# EAGLE design RPi-Power-HAT_v06 (EAGLE 6.4)
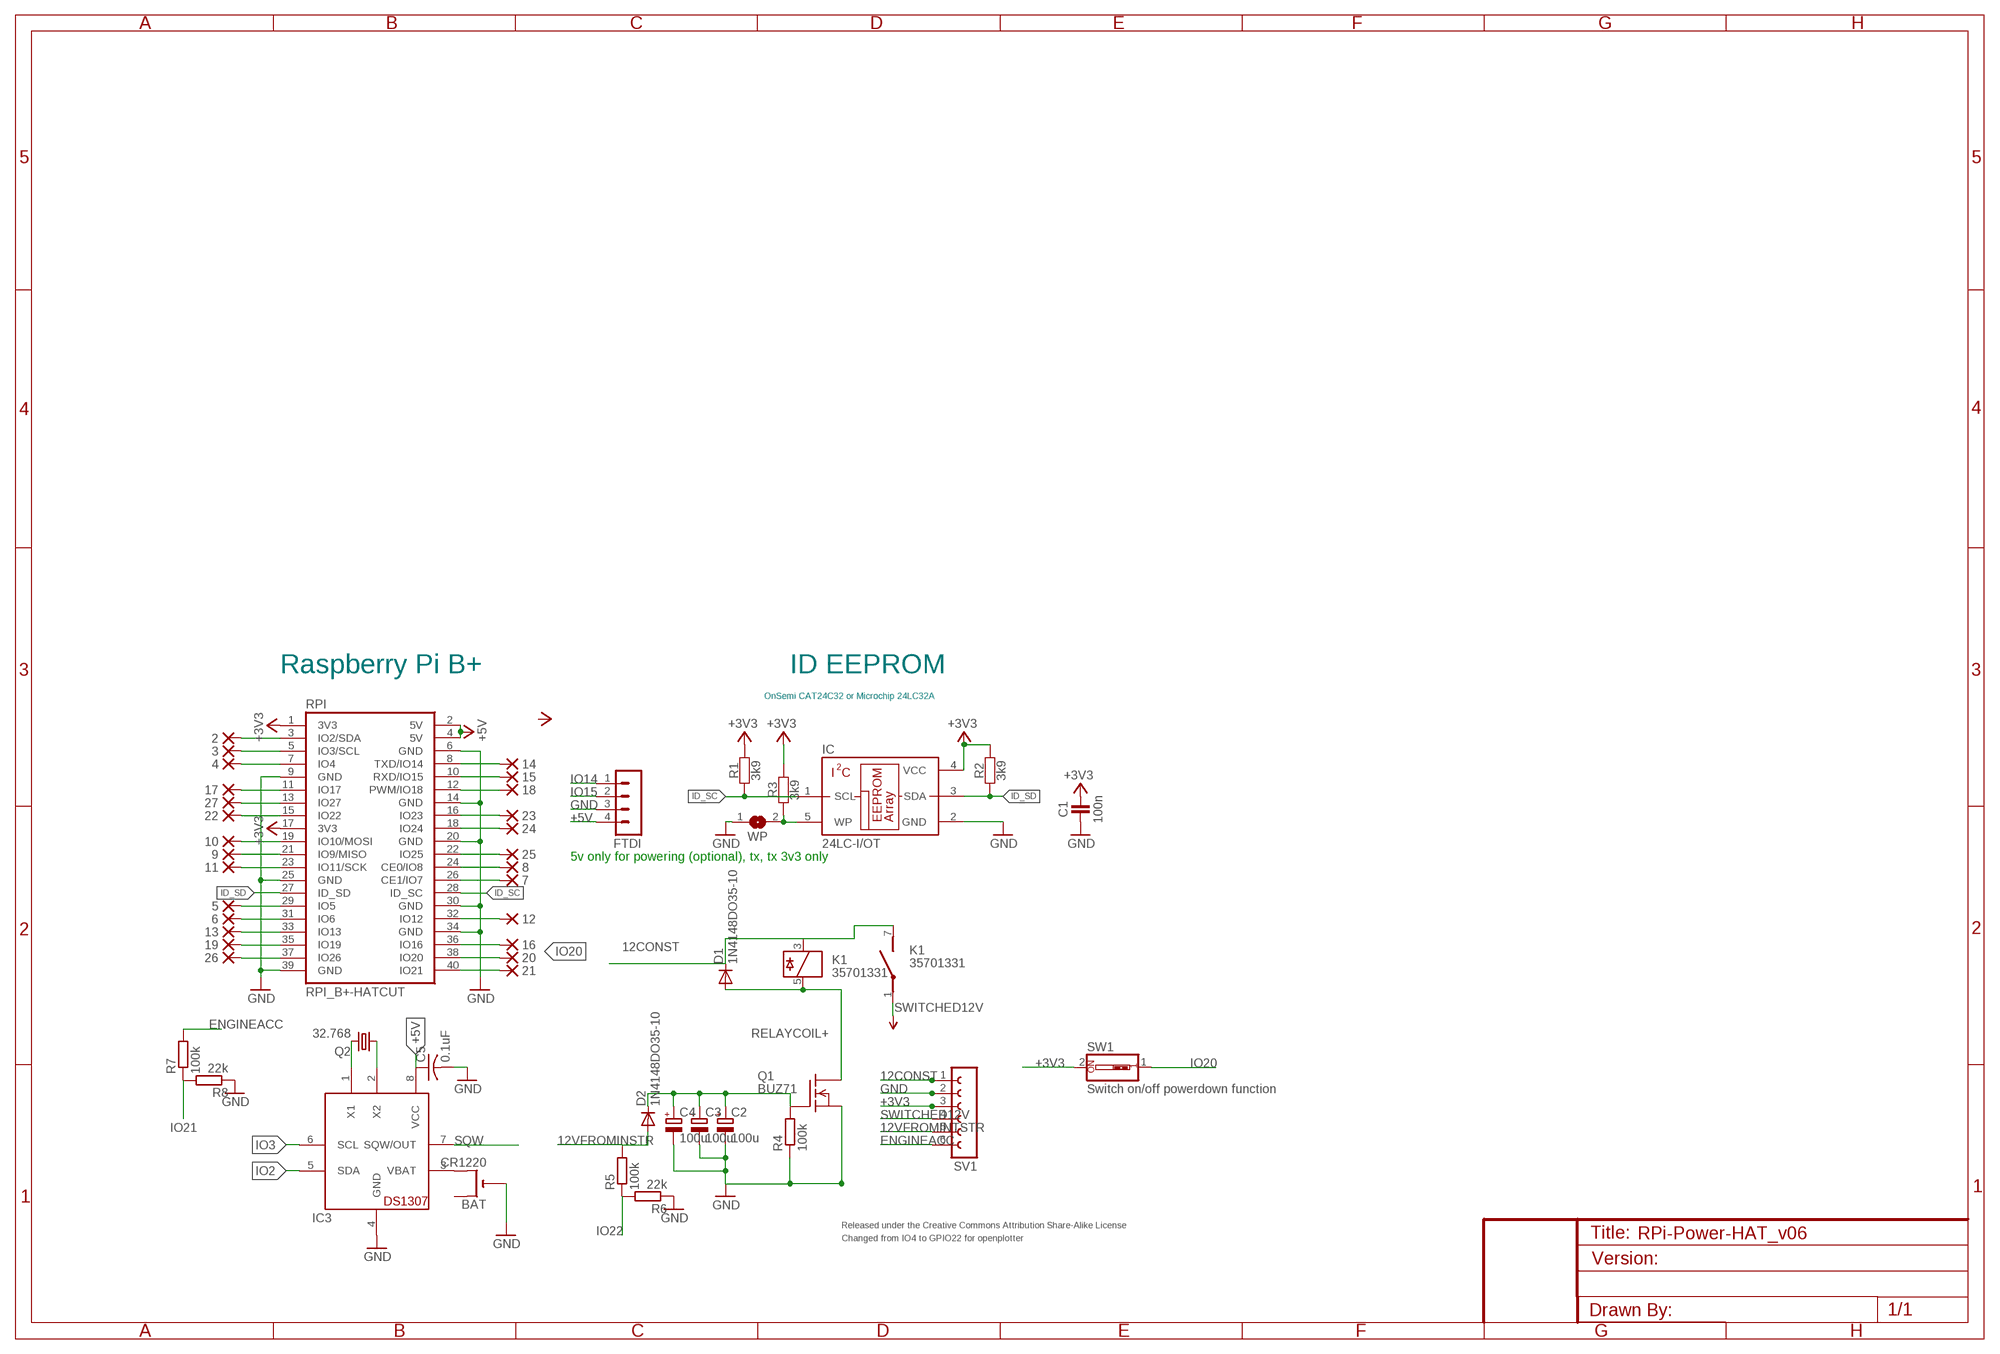
[diagram p0: schematic, sheet 1]

## Parts
2  PAD-1-1.6  [PAD-1-1.6]
3  PAD-1-1.6  [PAD-1-1.6]
4  PAD-1-1.6  [PAD-1-1.6]
5  PAD-1-1.6  [PAD-1-1.6]
6  PAD-1-1.6  [PAD-1-1.6]
7  PAD-1-1.6  [PAD-1-1.6]
8  PAD-1-1.6  [PAD-1-1.6]
9  PAD-1-1.6  [PAD-1-1.6]
10  PAD-1-1.6  [PAD-1-1.6]
11  PAD-1-1.6  [PAD-1-1.6]
12  PAD-1-1.6  [PAD-1-1.6]
13  PAD-1-1.6  [PAD-1-1.6]
14  PAD-1-1.6  [PAD-1-1.6]
15  PAD-1-1.6  [PAD-1-1.6]
16  PAD-1-1.6  [PAD-1-1.6]
17  PAD-1-1.6  [PAD-1-1.6]
18  PAD-1-1.6  [PAD-1-1.6]
19  PAD-1-1.6  [PAD-1-1.6]
20  PAD-1-1.6  [PAD-1-1.6]
21  PAD-1-1.6  [PAD-1-1.6]
22  PAD-1-1.6  [PAD-1-1.6]
23  PAD-1-1.6  [PAD-1-1.6]
24  PAD-1-1.6  [PAD-1-1.6]
25  PAD-1-1.6  [PAD-1-1.6]
26  PAD-1-1.6  [PAD-1-1.6]
27  PAD-1-1.6  [PAD-1-1.6]
BAT  CR1220  ADAFRUIT_CR1220THM  [ADAFRUIT_CR1220-THM]
C1  100n  CAPACITOR-C0603  [R0603]
C2  100u  CPOL-EUE2-4  [E2-4]
C3  100u  CPOL-EUE2-4  [E2-4]
C4  100u  CPOL-EUE2-4  [E2-4]
C5  0.1uF  C-US025-025X050  [C025-025X050]
D1  1N4148DO35-10  [DO35-10]
D2  1N4148DO35-10  [DO35-10]
FTDI  MA04-1  [MA04-1]
IC  24LC-I/OT  [SOT23-5]
IC3  DS1307  [DIL08]
K1  35701331  [REED]
Q1  BUZ71  [TO220]
Q2  32.768  CRYTALTC38H  [TC38H]
R1  3k9  RESISTOR-R0603  [R0603]
R2  3k9  RESISTOR-R0603  [R0603]
R3  3k9  RESISTOR-R0603  [R0603]
R4  100k  R-EU_0207/2V  [0207/2V]
R5  100k  R-EU_0207/2V  [0207/2V]
R6  22k  R-EU_0207/2V  [0207/2V]
R7  100k  R-EU_0207/2V  [0207/2V]
R8  22k  R-EU_0207/2V  [0207/2V]
RPI  RPI_B+-HATCUT  [RPI-B+HAT_CUTOUT]
SV1  FE06-1  [FE06]
SW1  Switch on/off powerdown function  SW_DIP-1  [EDG-01]
WP  JUMPER2-NOCREAM  [JUMPER2_NC]

## Nets
12CONST: D1.C K1.3 K1.7(2:S) SV1.1
12VFROMINSTR: D2.A R5.2
12VFROMINTSTR: SV1.5
+3V3: C1.2 IC.4(VCC) R1.2 R2.2 R3.2 RPI.1(3V3) RPI.17(3V3) SV1.3 SW1.2
+5V: FTDI.4 IC3.8(VCC) RPI.2(5V) RPI.4(5V)
ENGINEACC: R7.2 SV1.6
GND: BAT.- C1.1 C2.- C3.- C4.- C5.2 FTDI.3 IC3.4(GND) IC.2(GND) Q1.3(S) R4.1 R6.1 R8.1 RPI.6(GND) RPI.9(GND) RPI.14(GND) RPI.20(GND) RPI.25(GND) RPI.30(GND) RPI.34(GND) RPI.39(GND) SV1.2 WP.1
ID_SC: IC.1(SCL) R1.1 RPI.28(ID_SC)
ID_SD: IC.3(SDA) R2.1 RPI.27(ID_SD)
IO2: 2.1(P) IC3.5(SDA) RPI.3(IO2/SDA)
IO3: 3.1(P) IC3.6(SCL) RPI.5(IO3/SCL)
IO4: 4.1(P) RPI.7(IO4)
IO5: 5.1(P) RPI.29(IO5)
IO6: 6.1(P) RPI.31(IO6)
IO7: 7.1(P) RPI.26(CE1/IO7)
IO8: 8.1(P) RPI.24(CE0/IO8)
IO9: 9.1(P) RPI.21(IO9/MISO)
IO10: 10.1(P) RPI.19(IO10/MOSI)
IO11: 11.1(P) RPI.23(IO11/SCK)
IO12: 12.1(P) RPI.32(IO12)
IO13: 13.1(P) RPI.33(IO13)
IO14: 14.1(P) FTDI.1 RPI.8(TXD/IO14)
IO15: 15.1(P) FTDI.2 RPI.10(RXD/IO15)
IO16: 16.1(P) RPI.36(IO16)
IO17: 17.1(P) RPI.11(IO17)
IO18: 18.1(P) RPI.12(PWM/IO18)
IO19: 19.1(P) RPI.35(IO19)
IO20: 20.1(P) RPI.38(IO20) SW1.1
IO21: 21.1(P) R7.1 R8.2 RPI.40(IO21)
IO22: 22.1(P) R5.1 R6.2 RPI.15(IO22)
IO23: 23.1(P) RPI.16(IO23)
IO24: 24.1(P) RPI.18(IO24)
IO25: 25.1(P) RPI.22(IO25)
IO26: 26.1(P) RPI.37(IO26)
IO27: 27.1(P) RPI.13(IO27)
N$54: C2.+ C3.+ C4.+ D2.C Q1.1(G) R4.2
N$64: IC3.1(X1) Q2.2
N$110: IC3.2(X2) Q2.1
N$133: BAT.+2(+1) IC3.3(VBAT)
RELAYCOIL+: D1.A K1.5 Q1.2(D)
SQW: IC3.7(SQW/OUT)
SWITCHED12V: K1.1(2:P) SV1.4 ; supply symbol labelled VCC
WP: IC.5(WP) R3.1 WP.2
Unconnected: BAT.+1(+) C5.1

## Notes on the sheet
- Raspberry Pi B+ | ID EEPROM
- OnSemi CAT24C32 or Microchip 24LC32A
- 5v only for powering (optional), tx, tx 3v3 only
- Released under the Creative Commons Attribution Share-Alike License
- Changed from IO4 to GPIO22 for openplotter

## Library data of the parts
2-27 = we-rcl:PAD
BAT = RPi-Power-HAT_v02:ADAFRUIT_CR1220: CR1216/CR1220/CR1225 12mm 3V lithium coin cell Great for battery packup. Both SMT and THM holders. Note the THM package has the ground pads on both sides of the PCB so that the masks are the same - this reduces the cost
C1 = we-rcl:CAPACITOR: Capacitors ...2.2uF -> 0603 ...4.7uF -> 0805 ...10uF -> 1206
C2-C4 = resistor:CPOL-EU: POLARIZED CAPACITOR, European symbol
C5 = adafruit:C-US: CAPACITOR, American symbol
D1 D2 = diode:1N4148: DIODE high speed (Philips)
FTDI = con-lstb:MA04-1: PIN HEADER
IC = we-chip:24LC*: Microchip I2C EEPROM 2 Kbit - 24LC02B - 24LC02BT-I/OTDKR-ND 32 Kbit- 24LC32A - 24LC32AT-I/OTDKR-ND; DIGIKEY: 24LC32AT-I/OTDKR-ND
IC3 = adafruit:DS1307: DS1307 Real time clock (RTC) with battery backup ability. Talk to it via i2c
K1 = relay:35701331: RELAY reed, 1 x norm. open with polarity
Q1 = transistor-fet:BUZ71: N-Channel Enhancement MOSFET 50V; 14A; 0,1Ohm
Q2 = crystal:CRYTAL: CRYSTAL
R1-R3 = we-rcl:RESISTOR
R4-R8 = resistor:R-EU_: RESISTOR, European symbol
RPI = we-board:RPI_B+: Raspberry Pi Model B+
SV1 = con-lsta:FE06-1: FEMALE HEADER
SW1 = special:SW_DIP-1: DIP SWITCH
WP = we-rcl:JUMPER2

## Net classes
1 12v: width 0.508 mm

## Board
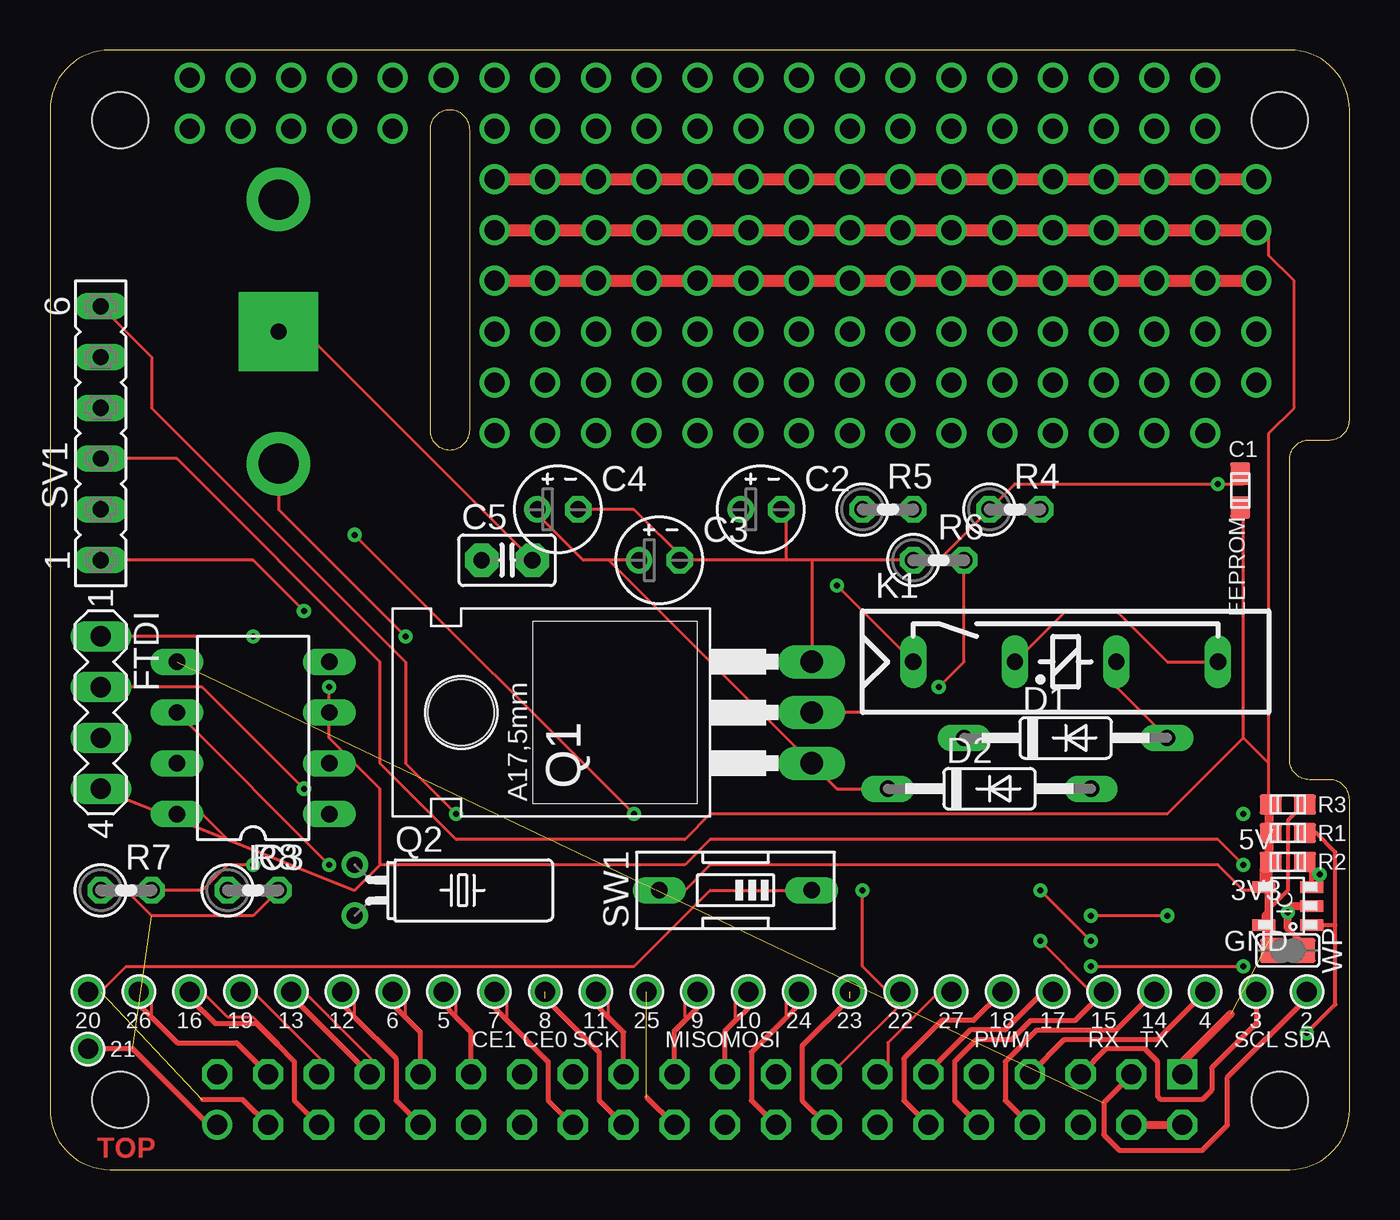
[diagram p1: board, top side]
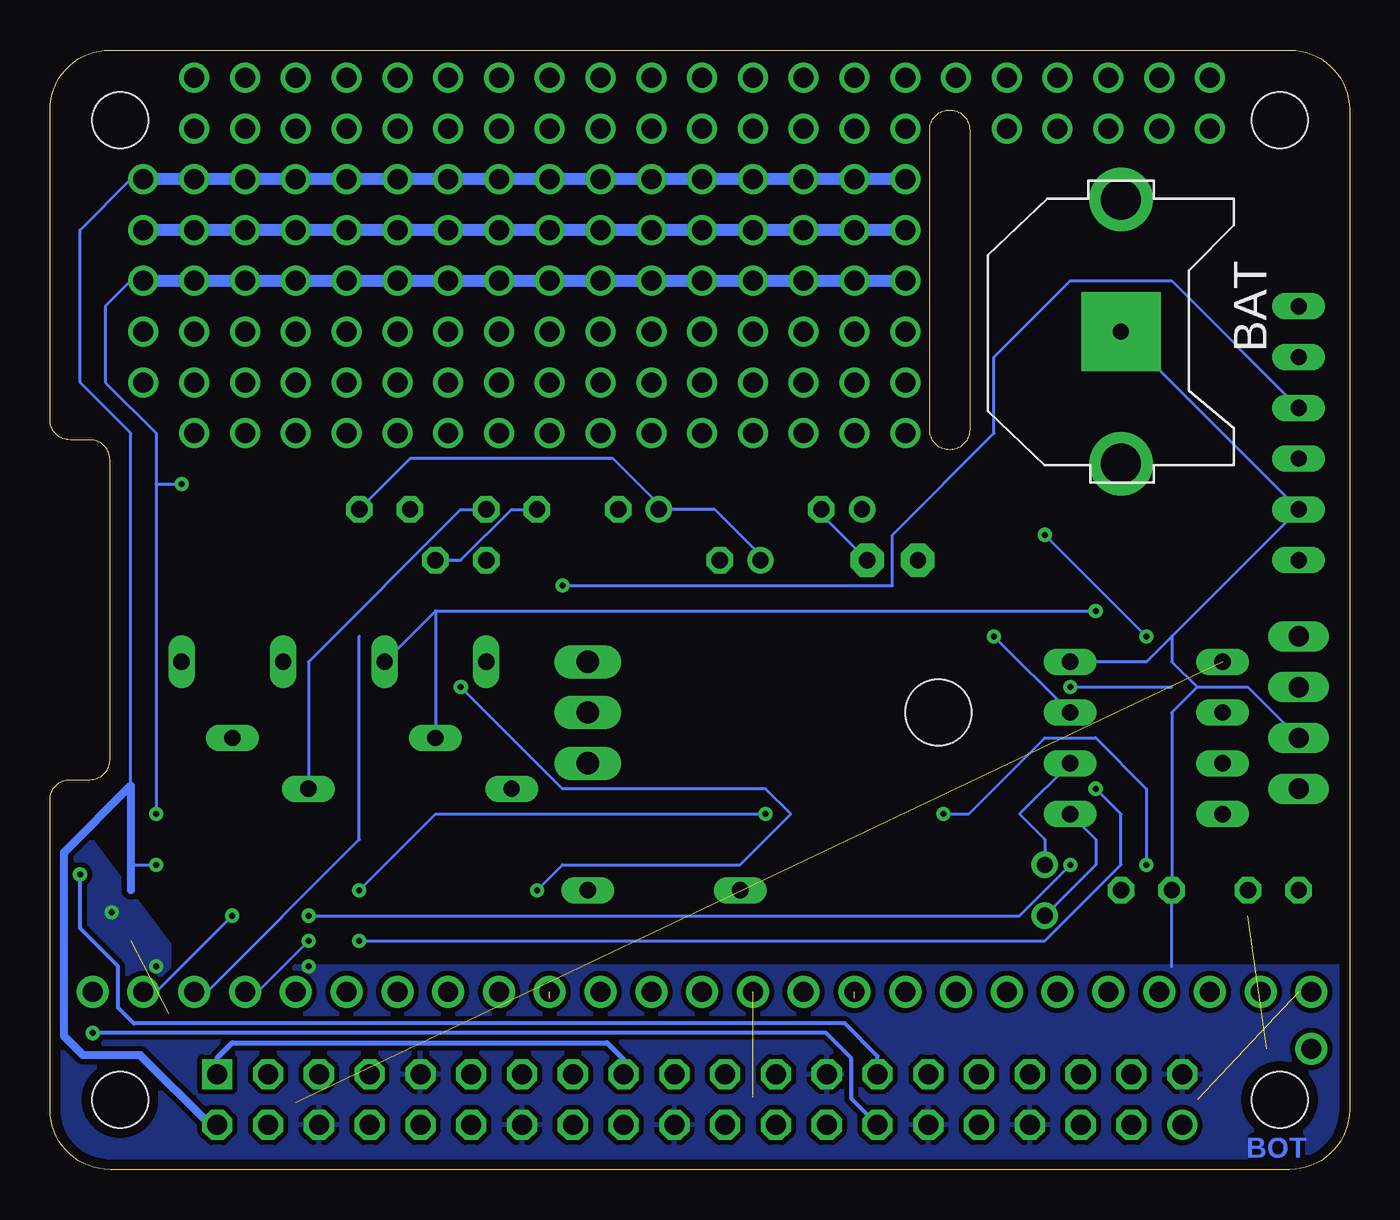
[diagram p2: board, bottom side, seen from below]

Size 65 x 56 mm. Coordinates in mm from the lower left corner, seen from the top.
Copper layers (1*16): Top 0.035mm / dielectric 1.5mm / Bottom 0.035mm
Design rules "default *": minimum track width 6mil, minimum drill 0.3mm, track to track 6mil, track to pad 6mil, pad to pad 6mil, via to via 6mil, smd to smd 6mil, copper to edge 20mil, drill to drill 8mil, minimum pad ring 10mil, minimum via ring 8mil, stop-mask expansion 0.3mm, vias tented up to drill 0.5mm, thermal gap 10mil

### Footprints (pad centres in the part's own frame; a part is rotated, then mirrored left to right if it is on the bottom)
PAD-1-1.6 = drill 1 pad 1.6: 1 0,0
ADAFRUIT_CR1220-THM = drill 2 pad 3.175: +1 -6.604,0; +2 6.604,0 | drill 0.8 pad 3.962 square: - 0,0
R0603 = smd 1 x 1.1: 1 0,0.85; 2 0,-0.85
E2-4 = drill 0.813 pad 1.27: + -1.016,0 | drill 0.813 pad 1.27 octagon: - 1.016,0
C025-025X050 = drill 0.813 pad 1.676 octagon: 1 -1.27,0; 2 1.27,0
DO35-10 = drill 0.813 long: A 5.08,0; C -5.08,0
MA04-1 = drill 1.016 long: 1 -3.81,0; 2 -1.27,0; 3 1.27,0; 4 3.81,0
SOT23-5 = smd 1.2 x 0.6: 1 -1.2,0.95; 2 -1.2,0; 3 -1.2,-0.95; 4 1.2,-0.95; 5 1.2,0.95
DIL08 = drill 0.813 long: 1 -3.81,-3.81; 2 -1.27,-3.81; 3 1.27,-3.81; 4 3.81,-3.81; 5 3.81,3.81; 6 1.27,3.81; 7 -1.27,3.81; 8 -3.81,3.81
REED = drill 0.813 long: 1 -17.78,2.54; 3 -12.7,2.54; 5 -7.62,2.54; 7 -2.54,2.54
TO220 = drill 1.118 long: 1 -2.54,-6.35; 2 0,-6.35; 3 2.54,-6.35 | hole 3.302: 0,11.176
TC38H = drill 0.813: 1 -1.27,0; 2 1.27,0
0207/2V = drill 0.813 octagon: 1 -1.27,0; 2 1.27,0
RPI-B+HAT_CUTOUT = drill 1 square: 1 56.63,4.77 | drill 1 octagon: 2 56.63,2.23; 3 54.09,4.77; 4 54.09,2.23; 5 51.55,4.77; 6 51.55,2.23; 7 49.01,4.77; 8 49.01,2.23; 9 46.47,4.77; 10 46.47,2.23; 11 43.93,4.77; 12 43.93,2.23; 13 41.39,4.77; 14 41.39,2.23; 15 38.85,4.77; 16 38.85,2.23; 17 36.31,4.77; 18 36.31,2.23; 19 33.77,4.77; 20 33.77,2.23; 21 31.23,4.77; 22 31.23,2.23; 23 28.69,4.77; 24 28.69,2.23; 25 26.15,4.77; 26 26.15,2.23; 27 23.61,4.77; 28 23.61,2.23; 29 21.07,4.77; 30 21.07,2.23; 31 18.53,4.77; 32 18.53,2.23; 33 15.99,4.77; 34 15.99,2.23; 35 13.45,4.77; 36 13.45,2.23; 37 10.91,4.77; 38 10.91,2.23; 39 8.37,4.77 | drill 1: 40 8.37,2.23 | hole 2.8: 3.5,3.5; 3.5,52.5; 61.5,52.5; 61.5,3.5
FE06 = drill 0.813 long: 1 -6.35,0; 2 -3.81,0; 3 -1.27,0; 4 1.27,0; 5 3.81,0; 6 6.35,0
EDG-01 = drill 0.813 long: 1 0,-3.81; 2 0,3.81
JUMPER2_NC = smd 1.25 x 1.25: 1 0,0.76; 2 0,-0.76

### Placement (x,y rotation side)
2  62.87,8.89 0 top
3  60.33,8.89 0 top
4  57.78,8.89 0 top
5  19.68,8.89 0 top
6  17.14,8.89 0 top
7  22.23,8.89 0 top
8  24.77,8.89 0 top
9  32.38,8.89 0 top
10  34.92,8.89 0 top
11  27.3,8.89 0 top
12  14.61,8.89 0 top
13  12.06,8.89 0 top
14  55.24,8.89 0 top
15  52.7,8.89 0 top
16  6.99,8.89 0 top
17  50.16,8.89 0 top
18  47.62,8.89 0 top
19  9.53,8.89 0 top
20  1.91,8.89 0 top
21  1.91,6.03 0 top
22  42.55,8.89 0 top
23  40.01,8.89 0 top
24  37.47,8.89 0 top
25  29.84,8.89 0 top
26  4.45,8.89 0 top
27  45.09,8.89 0 top
BAT  11.43,41.91 270 bottom
C1  59.53,33.97 0 top
C2  35.56,33.02 0 top
C3  30.48,30.48 0 top
C4  25.4,33.02 0 top
C5  22.86,30.48 0 top
D1  50.8,21.59 0 top
D2  46.99,19.05 0 top
FTDI  2.54,22.86 270 top
IC  61.91,13.18 180 top
IC3  10.16,21.59 90 top
K1  60.96,22.86 0 top
Q1  31.75,22.86 90 top
Q2  15.24,13.97 270 top
R1  61.91,16.83 270 top
R2  61.91,15.4 270 top
R3  61.91,18.26 270 top
R4  48.26,33.02 0 top
R5  41.91,33.02 0 top
R6  44.45,30.48 0 top
R7  3.81,13.97 0 top
R8  10.16,13.97 0 top
RPI  0,0 0 top
SV1  2.54,36.83 90 top
SW1  34.29,13.97 90 top
WP  61.91,10.95 270 top

### Tracks (layer width: path | path; a pad name or v marks a point on that pad's centre or on a via)
12CONST  (via drill 0.3)
  Top 0.152: K1.7 55.88,25.4 53.34,27.94 50.8,27.94 K1.3 | SV1.1 10.16,30.48 v12.7,27.94
  Bottom 0.152: 45.72,27.94 v12.7,27.94 | K1.3 45.72,27.94 | 45.72,27.94 D1.C
12VFROMINSTR
  Bottom 0.152: D2.A 52.07,25.4 44.45,33.02 R5.2
+3V3  (via drill 1)  (1 unrouted)
  Top 0.152: 59.69,21.59 59.69,33.02 C1.2 | 60.96,20.32 59.69,21.59 | 60.96,20.32 60.96,17.78 R3.2 | 60.96,16.51 R1.2 | 60.96,20.32 60.96,36.83 62.23,38.1 62.23,44.45 60.96,45.72 60.96,46.99 v60.33,46.99 | SW1.2 31.75,13.97 33.02,15.24 58.42,15.24 59.69,13.97 60.96,13.97 IC.4 | SV1.3 6.35,35.56 16.51,25.4 16.51,20.32 20.32,16.51 31.75,16.51 33.02,17.78 55.88,17.78 59.69,21.59
  Top 0.254: R1.2 R3.2 60.96,18.36 | R1.2 61.06,16.73 61.12,16.67 61.12,16.77 R1.2 | R1.2 R2.2 60.93,15.27 60.71,15.05
  Top 0.406: IC.4 60.71,15.05 | 60.86,15.34 60.93,15.27 | 60.96,11.43 60.96,13.97 60.96,16.51 60.96,17.78 60.96,18.36 | RPI.1 56.63,5.35 59.05,7.78
  Top 0.61: v22.23,46.99 v60.33,46.99
  Bottom 0.254: RPI.1 56.63,5.6 55.88,6.35 37.15,6.35 36.31,5.51 RPI.17
  Bottom 0.61: v22.23,46.99 v60.33,46.99
+5V  (via drill 0.3, 1)
  Top 0.152: v13.97,24.13 13.97,21.59 16.51,19.05 16.51,15.24 | 16.51,15.24 15.24,13.97 8.89,16.51 | FTDI.4 8.89,16.51 | 16.51,15.24 31.75,15.24 33.02,16.51 58.42,16.51 v59.69,15.24 | IC3.8 7.62,17.78 8.89,16.51
  Top 0.406: RPI.4 RPI.2
  Top 0.61: v22.23,49.53 v60.33,49.53
  Bottom 0.152: 60.96,15.24 v59.69,15.24 | 60.96,19.05 60.96,36.83 63.5,39.37 63.5,46.99 60.96,49.53 v60.33,49.53 | v13.97,24.13 8.89,24.13
  Bottom 0.406: RPI.2 57,2.23 60.48,5.71 63.34,5.71 64.29,6.67 64.29,15.88 60.96,19.21 60.96,19.05 60.96,15.24 60.96,13.97
  Bottom 0.61: v22.23,49.53 v60.33,49.53
ENGINEACC  (via drill 0.3)
  Top 0.152: R7.2 7.62,13.97 8.89,15.24 v10.16,15.24 | v20.32,17.78 17.78,20.32 17.78,25.4 5.08,38.1 5.08,40.64 SV1.6
  Bottom 0.152: v10.16,15.24 10.16,19.05 12.7,21.59 15.24,21.59 19.05,17.78 v20.32,17.78
GND  (via drill 0.3, 1)
  Top 0.152: C1.1 59.69,34.29 v58.42,34.29 48.26,34.29 R4.1 44.45,30.48 R6.1 38.1,30.48 | v52.07,10.16 v59.69,10.16 | 38.1,30.48 36.83,30.48 | 36.83,30.48 31.75,30.48 | C4.- 29.21,33.02 31.75,30.48 | 31.75,30.48 C3.- | 36.83,30.48 36.83,33.02 C2.- | 38.1,30.48 Q1.3 | C5.2 12.7,41.91 BAT.-
  Top 0.254: WP.1 62.67,11.3 61.91,12.06 | v61.91,12.86 61.91,13.02
  Top 0.406: 61.91,12.06 v61.91,12.86 | 61.91,13.02 62.07,13.18 IC.2
  Top 0.61: v22.23,44.45 v60.33,44.45
  Bottom 0.152: 59.69,34.29 59.69,36.83 62.23,39.37 62.23,43.18 60.96,44.45 v60.33,44.45 | 59.69,34.29 v59.69,17.78 | 59.69,34.29 v58.42,34.29 | C5.2 26.67,33.02 C4.- | 8.89,10.16 R8.1 8.89,22.86 7.62,24.13 | BAT.- SV1.2 8.89,26.67 | IC3.4 10.16,25.4 8.89,26.67 | FTDI.3 5.08,24.13 7.62,24.13 | 7.62,24.13 8.89,25.4 8.89,26.67 | v52.07,10.16
  Bottom 0.61: v60.33,44.45 v22.23,44.45
  pour Bottom (isolate 0.254): 0.32,0 64.77,0 64.77,10.16 0.32,10.16
  pour Bottom (isolate 0.254): 59.05,10.16 64.77,10.16 64.77,18.89 59.05,11.27
ID_SC  (via drill 0.3)
  Top 0.203: 64.29,12.22 64.29,15.88 63.34,16.83 R1.1 | 64.29,12.22 IC.1 | v62.87,6.83 64.29,8.26 64.29,12.22
  Bottom 0.203: RPI.28 24.92,3.54 24.92,5.56 26.19,6.83 v62.87,6.83
ID_SD  (via drill 0.3)
  Top 0.254: IC.3 63.11,14.76 | 63.11,14.76 63.11,15.05 R2.1 | v63.5,14.76 63.11,14.76
  Bottom 0.203: RPI.27 23.61,5.67 25.24,7.3 60.8,7.3 61.59,8.1 61.59,10.16 63.5,12.06 v63.5,14.76
IO2  (1 unrouted)
  Top 0.254: 2.1 62.87,8.57 58.9,4.6 58.9,2.22 57.63,0.95 53.5,0.95 52.7,1.75 52.7,3.33 54.09,4.72 RPI.3
IO3  (via drill 0.3)
  Top 0.152: v13.97,15.24 IC3.6 | v55.88,12.7 v52.07,12.7
  Top 0.254: 3.1 60.33,7.3 58.1,5.08 58.1,3.97 57.63,3.49 55.56,3.49 55.4,3.65 55.4,5.4 54.77,6.03 52.81,6.03 RPI.5
  Bottom 0.152: v13.97,15.24 16.51,12.7 v52.07,12.7 | v55.88,12.7 59.69,8.89 3.1
IO4
  Top 0.254: RPI.7 50.75,6.51 55.4,6.51 4.1
  Bottom 0.152: 49.53,26.67 49.53,16.51 57.15,8.89 4.1
IO5
  Top 0.152: 20.32,7.62 20.32,8.89 5.1
  Top 0.254: 19.68,8.26 20.32,7.62 21.07,6.87 RPI.29
IO6
  Top 0.152: 17.78,7.62 17.78,8.89 6.1
  Top 0.254: 17.14,8.26 17.78,7.62 18.53,6.87 RPI.31
IO7
  Top 0.152: 7.1 22.86,8.89 22.86,7.62 22.78,7.54
  Top 0.254: 22.23,8.1 22.78,7.54 24.92,5.4 24.92,3.46 RPI.26
IO8  (1 unrouted)
  Top 0.254: 24.77,8.57 27.46,5.87 27.46,3.46 RPI.24
IO9
  Top 0.152: 9.1 31.75,8.89 31.75,7.62 31.83,7.54
  Top 0.254: RPI.21 31.23,6.94 31.83,7.54 32.38,8.1
IO10
  Top 0.152: 10.1 34.29,8.89 34.29,7.62 34.37,7.54
  Top 0.254: RPI.19 33.77,6.94 34.37,7.54 34.92,8.1
IO11
  Top 0.152: 27.94,7.62 27.94,8.89 11.1
  Top 0.254: RPI.23 28.69,6.87 27.94,7.62 27.3,8.26
IO12
  Top 0.152: 15.24,7.62 15.24,8.89 12.1
  Top 0.254: 14.61,8.26 15.24,7.62 17.3,5.56 17.3,3.46 RPI.32
IO13
  Top 0.152: 13.1 12.7,8.89 16.51,5.08 RPI.33
  Top 0.254: 12.06,8.7 RPI.33
IO14  (via drill 0.3)
  Top 0.152: v10.16,26.67 FTDI.1 | v29.21,17.78 v15.24,31.75 | v52.07,11.43 v49.53,13.97
  Top 0.254: RPI.8 47.78,3.46 47.78,5.4 49.37,6.99 53.34,6.99 14.1
  Bottom 0.152: v15.24,31.75 v10.16,26.67 | v29.21,17.78 45.72,17.78 v49.53,13.97 | v52.07,11.43 54.61,8.89 14.1
IO15  (via drill 0.3)
  Top 0.152: FTDI.2 7.62,24.13 v12.7,19.05 | v49.53,11.43 52.07,8.89 15.1
  Top 0.254: 15.1 51.28,7.46 49.05,7.46 48.1,6.51 46.35,6.51 45.24,5.4 45.24,3.46 RPI.10
  Bottom 0.152: v12.7,19.05 11.43,17.78 11.43,15.24 15.24,11.43 v49.53,11.43
IO16
  Top 0.152: 16.1 7.62,8.89 8.89,7.62 10.16,7.62 11.43,6.35 11.35,6.27
  Top 0.254: 6.99,8.57 8.26,7.3 10.32,7.3 11.35,6.27 12.22,5.4 12.22,3.46 RPI.36
IO17
  Top 0.254: RPI.11 43.93,4.88 46.04,6.99 47.78,6.99 49.69,8.89 17.1
IO18
  Top 0.254: 18.1 46.2,7.46 44.61,7.46 42.7,5.56 42.7,3.46 RPI.12
IO19
  Top 0.152: RPI.35 13.97,5.08 10.16,8.89 19.1
  Top 0.254: RPI.35 13.45,5.12
IO20  (1 unrouted)
  Top 0.152: SW1.1 33.02,13.97 29.21,10.16 3.81,10.16 2.54,8.89 20.1
  Top 0.254: 7.62,3.49 9.65,3.49 RPI.38
IO21  (1 unrouted)
  Top 0.152: R7.1 3.81,13.97 5.08,12.7 10.16,12.7 R8.2
  Top 0.254: RPI.40 7.93,2.23 4.13,6.03 21.1
IO22  (via drill 0.3)
  Top 0.152: RPI.15 39.37,5.08 43.18,8.89 22.1 41.91,8.89 40.64,10.16 v40.64,13.97 | R6.2 45.72,25.4 v44.45,24.13
  Top 0.254: RPI.15 38.85,5.2
  Bottom 0.152: R5.1 41.91,33.02 44.45,30.48 R6.2 | v44.45,24.13 39.37,19.05 29.21,19.05 27.94,17.78 30.48,15.24 39.37,15.24 v40.64,13.97
IO23  (1 unrouted)
  Top 0.254: 40.01,8.57 37.62,6.19 37.62,3.46 RPI.16
IO24
  Top 0.152: 36.83,7.62 36.83,8.89 24.1
  Top 0.254: 37.47,8.26 36.83,7.62 35.08,5.87 35.08,3.46 RPI.18
IO25  (1 unrouted)
  Top 0.254: 29.84,3.62 RPI.22
IO26
  Top 0.152: 5.08,7.62 5.08,8.89 26.1
  Top 0.254: 4.45,8.26 5.08,7.62 6.35,6.35 9.33,6.35 RPI.37
IO27
  Top 0.152: RPI.13 41.91,5.08 41.91,6.35 44.45,8.89 27.1
  Top 0.254: RPI.13 41.39,5.2
N$54
  Top 0.152: D2.C 39.37,19.05 Q1.1 27.94,30.48 | C3.+ 27.94,30.48 | 27.94,30.48 26.67,30.48 24.13,33.02 C4.+
  Bottom 0.152: R4.2 46.99,35.56 36.83,35.56 34.29,33.02 | 34.29,33.02 31.75,33.02 29.21,30.48 C3.+ | 34.29,33.02 C2.+
N$64
  Bottom 0.152: Q2.2 12.7,15.24 12.7,16.51 IC3.1
N$67  (via drill 1)
  other vias: 6.99,52.07
N$68  (via drill 1)
  other vias: 6.99,54.61
N$69  (via drill 1)
  other vias: 9.53,52.07
N$70  (via drill 1)
  other vias: 9.53,54.61
N$71  (via drill 1)
  other vias: 12.06,54.61
N$72  (via drill 1)
  other vias: 12.06,52.07
N$73  (via drill 1)
  other vias: 14.61,52.07
N$74  (via drill 1)
  other vias: 14.61,54.61
N$75  (via drill 1)
  other vias: 17.14,54.61
N$76  (via drill 1)
  other vias: 17.14,52.07
N$77  (via drill 1)
  other vias: 19.68,54.61
N$79  (via drill 1)
  other vias: 22.23,52.07
N$80  (via drill 1)
  other vias: 22.23,54.61
N$81  (via drill 1)
  other vias: 24.77,54.61
N$82  (via drill 1)
  other vias: 24.77,52.07
N$83  (via drill 1)
  other vias: 27.3,52.07
N$84  (via drill 1)
  other vias: 27.3,54.61
N$85  (via drill 1)
  other vias: 29.84,52.07
N$86  (via drill 1)
  other vias: 29.84,54.61
N$87  (via drill 1)
  other vias: 32.38,54.61
N$88  (via drill 1)
  other vias: 32.38,52.07
N$89  (via drill 1)
  other vias: 34.92,52.07
N$90  (via drill 1)
  other vias: 34.92,54.61
N$91  (via drill 1)
  other vias: 37.47,54.61
N$92  (via drill 1)
  other vias: 37.47,52.07
N$93  (via drill 1)
  other vias: 40.01,52.07
N$94  (via drill 1)
  other vias: 40.01,54.61
N$95  (via drill 1)
  other vias: 42.55,54.61
N$96  (via drill 1)
  other vias: 42.55,52.07
N$97  (via drill 1)
  other vias: 45.09,52.07
N$98  (via drill 1)
  other vias: 45.09,54.61
N$99  (via drill 1)
  other vias: 47.62,54.61
N$100  (via drill 1)
  other vias: 47.62,52.07
N$101  (via drill 1)
  other vias: 50.16,52.07
N$102  (via drill 1)
  other vias: 50.16,54.61
N$103  (via drill 1)
  other vias: 52.7,54.61
N$104  (via drill 1)
  other vias: 52.7,52.07
N$105  (via drill 1)
  other vias: 55.24,52.07
N$106  (via drill 1)
  other vias: 55.24,54.61
N$107  (via drill 1)
  other vias: 57.78,54.61
N$108  (via drill 1)
  other vias: 57.78,52.07
N$110
  Bottom 0.152: Q2.1 15.24,16.51 16.51,17.78 IC3.2
N$133  (via drill 0.3)
  Top 0.152: v17.78,26.67 11.43,33.02 BAT.+2
  Bottom 0.152: v17.78,26.67 IC3.3
N$154  (via drill 1)
  other vias: 22.23,41.91
N$157  (via drill 1)
  other vias: 24.77,41.91
N$186  (via drill 1)
  other vias: 27.3,41.91
N$187  (via drill 1)
  other vias: 29.84,41.91
N$188  (via drill 1)
  other vias: 32.38,41.91
N$189  (via drill 1)
  other vias: 34.92,41.91
N$190  (via drill 1)
  other vias: 37.47,41.91
N$191  (via drill 1)
  other vias: 40.01,41.91
N$192  (via drill 1)
  other vias: 42.55,41.91
N$193  (via drill 1)
  other vias: 45.09,41.91
N$194  (via drill 1)
  other vias: 47.62,41.91
N$195  (via drill 1)
  other vias: 50.16,41.91
N$196  (via drill 1)
  other vias: 52.7,41.91
N$197  (via drill 1)
  other vias: 55.24,41.91
N$198  (via drill 1)
  other vias: 57.78,41.91
N$199  (via drill 1)
  other vias: 60.33,41.91
N$205  (via drill 1)
  other vias: 57.78,49.53
N$207  (via drill 1)
  other vias: 57.78,46.99
N$209  (via drill 1)
  other vias: 57.78,44.45
N$218  (via drill 1)
  other vias: 22.23,39.37
N$219  (via drill 1)
  other vias: 24.77,39.37
N$221  (via drill 1)
  other vias: 22.23,36.83
N$222  (via drill 1)
  other vias: 24.77,36.83
N$225  (via drill 1)
  other vias: 24.77,49.53
N$226  (via drill 1)
  other vias: 24.77,46.99
N$229  (via drill 1)
  other vias: 27.3,39.37
N$230  (via drill 1)
  other vias: 29.84,39.37
N$231  (via drill 1)
  other vias: 27.3,36.83
N$232  (via drill 1)
  other vias: 29.84,36.83
N$233  (via drill 1)
  other vias: 27.3,49.53
N$234  (via drill 1)
  other vias: 29.84,49.53
N$235  (via drill 1)
  other vias: 27.3,46.99
N$236  (via drill 1)
  other vias: 29.84,46.99
N$238  (via drill 1)
  other vias: 60.33,39.37
N$239  (via drill 1)
  other vias: 57.78,39.37
N$240  (via drill 1)
  other vias: 55.24,39.37
N$241  (via drill 1)
  other vias: 52.7,39.37
N$242  (via drill 1)
  other vias: 50.16,39.37
N$243  (via drill 1)
  other vias: 47.62,39.37
N$244  (via drill 1)
  other vias: 45.09,39.37
N$245  (via drill 1)
  other vias: 42.55,39.37
N$246  (via drill 1)
  other vias: 40.01,39.37
N$247  (via drill 1)
  other vias: 37.47,39.37
N$248  (via drill 1)
  other vias: 34.92,39.37
N$249  (via drill 1)
  other vias: 32.38,39.37
N$250  (via drill 1)
  other vias: 32.38,36.83
N$251  (via drill 1)
  other vias: 32.38,49.53
N$252  (via drill 1)
  other vias: 32.38,46.99
N$253  (via drill 1)
  other vias: 34.92,46.99
N$254  (via drill 1)
  other vias: 34.92,49.53
N$255  (via drill 1)
  other vias: 34.92,36.83
N$256  (via drill 1)
  other vias: 37.47,36.83
N$257  (via drill 1)
  other vias: 37.47,49.53
N$258  (via drill 1)
  other vias: 37.47,46.99
N$259  (via drill 1)
  other vias: 40.01,46.99
N$260  (via drill 1)
  other vias: 40.01,49.53
N$261  (via drill 1)
  other vias: 40.01,36.83
N$262  (via drill 1)
  other vias: 42.55,36.83
N$265  (via drill 1)
  other vias: 57.78,36.83
N$266  (via drill 1)
  other vias: 55.24,36.83
N$267  (via drill 1)
  other vias: 52.7,36.83
N$268  (via drill 1)
  other vias: 50.16,36.83
N$269  (via drill 1)
  other vias: 47.62,36.83
N$270  (via drill 1)
  other vias: 45.09,36.83
N$271  (via drill 1)
  other vias: 42.55,49.53
N$272  (via drill 1)
  other vias: 45.09,49.53
N$273  (via drill 1)
  other vias: 47.62,49.53
N$274  (via drill 1)
  other vias: 50.16,49.53
N$275  (via drill 1)
  other vias: 52.7,49.53
N$276  (via drill 1)
  other vias: 55.24,49.53
N$283  (via drill 1)
  other vias: 55.24,46.99
N$284  (via drill 1)
  other vias: 52.7,46.99
N$285  (via drill 1)
  other vias: 50.16,46.99
N$286  (via drill 1)
  other vias: 47.62,46.99
N$287  (via drill 1)
  other vias: 45.09,46.99
N$288  (via drill 1)
  other vias: 42.55,46.99
N$339  (via drill 1)
  other vias: 55.24,44.45
N$340  (via drill 1)
  other vias: 52.7,44.45
N$341  (via drill 1)
  other vias: 50.16,44.45
N$381  (via drill 1)
  other vias: 24.77,44.45
N$382  (via drill 1)
  other vias: 27.3,44.45
N$383  (via drill 1)
  other vias: 29.84,44.45
N$384  (via drill 1)
  other vias: 32.38,44.45
N$413  (via drill 1)
  other vias: 34.92,44.45
N$414  (via drill 1)
  other vias: 37.47,44.45
N$415  (via drill 1)
  other vias: 40.01,44.45
N$416  (via drill 1)
  other vias: 42.55,44.45
N$417  (via drill 1)
  other vias: 45.09,44.45
N$418  (via drill 1)
  other vias: 47.62,44.45
RELAYCOIL+
  Top 0.152: 54.61,22.86 53.34,24.13 K1.5 | 54.61,22.86 D1.A | 54.61,22.86 Q1.2
SWITCHED12V  (via drill 0.3)
  Top 0.152: K1.1 v39.37,29.21
  Bottom 0.152: SV1.4 8.89,44.45 13.97,44.45 17.78,40.64 17.78,36.83 22.86,31.75 22.86,29.21 v39.37,29.21
WP
  Top 0.203: R3.1 62.71,18.26 61.91,17.46 61.91,13.97 60.71,12.77 IC.5 60.71,11.39 WP.2
  Top 0.254: IC.5

### Text on the board
Top: TOP
Bottom: BOT
tPlace: EEPROM
tNames: 5V | 3V3 | GND | CE1 | CE0 | SCK | MISO | MOSI | PWM | RX | TX | SCL | SDA
Reference: Silkscreen: 21 tPlace + 25 tNames